# EAGLE design sib_schem (EAGLE 5.11)
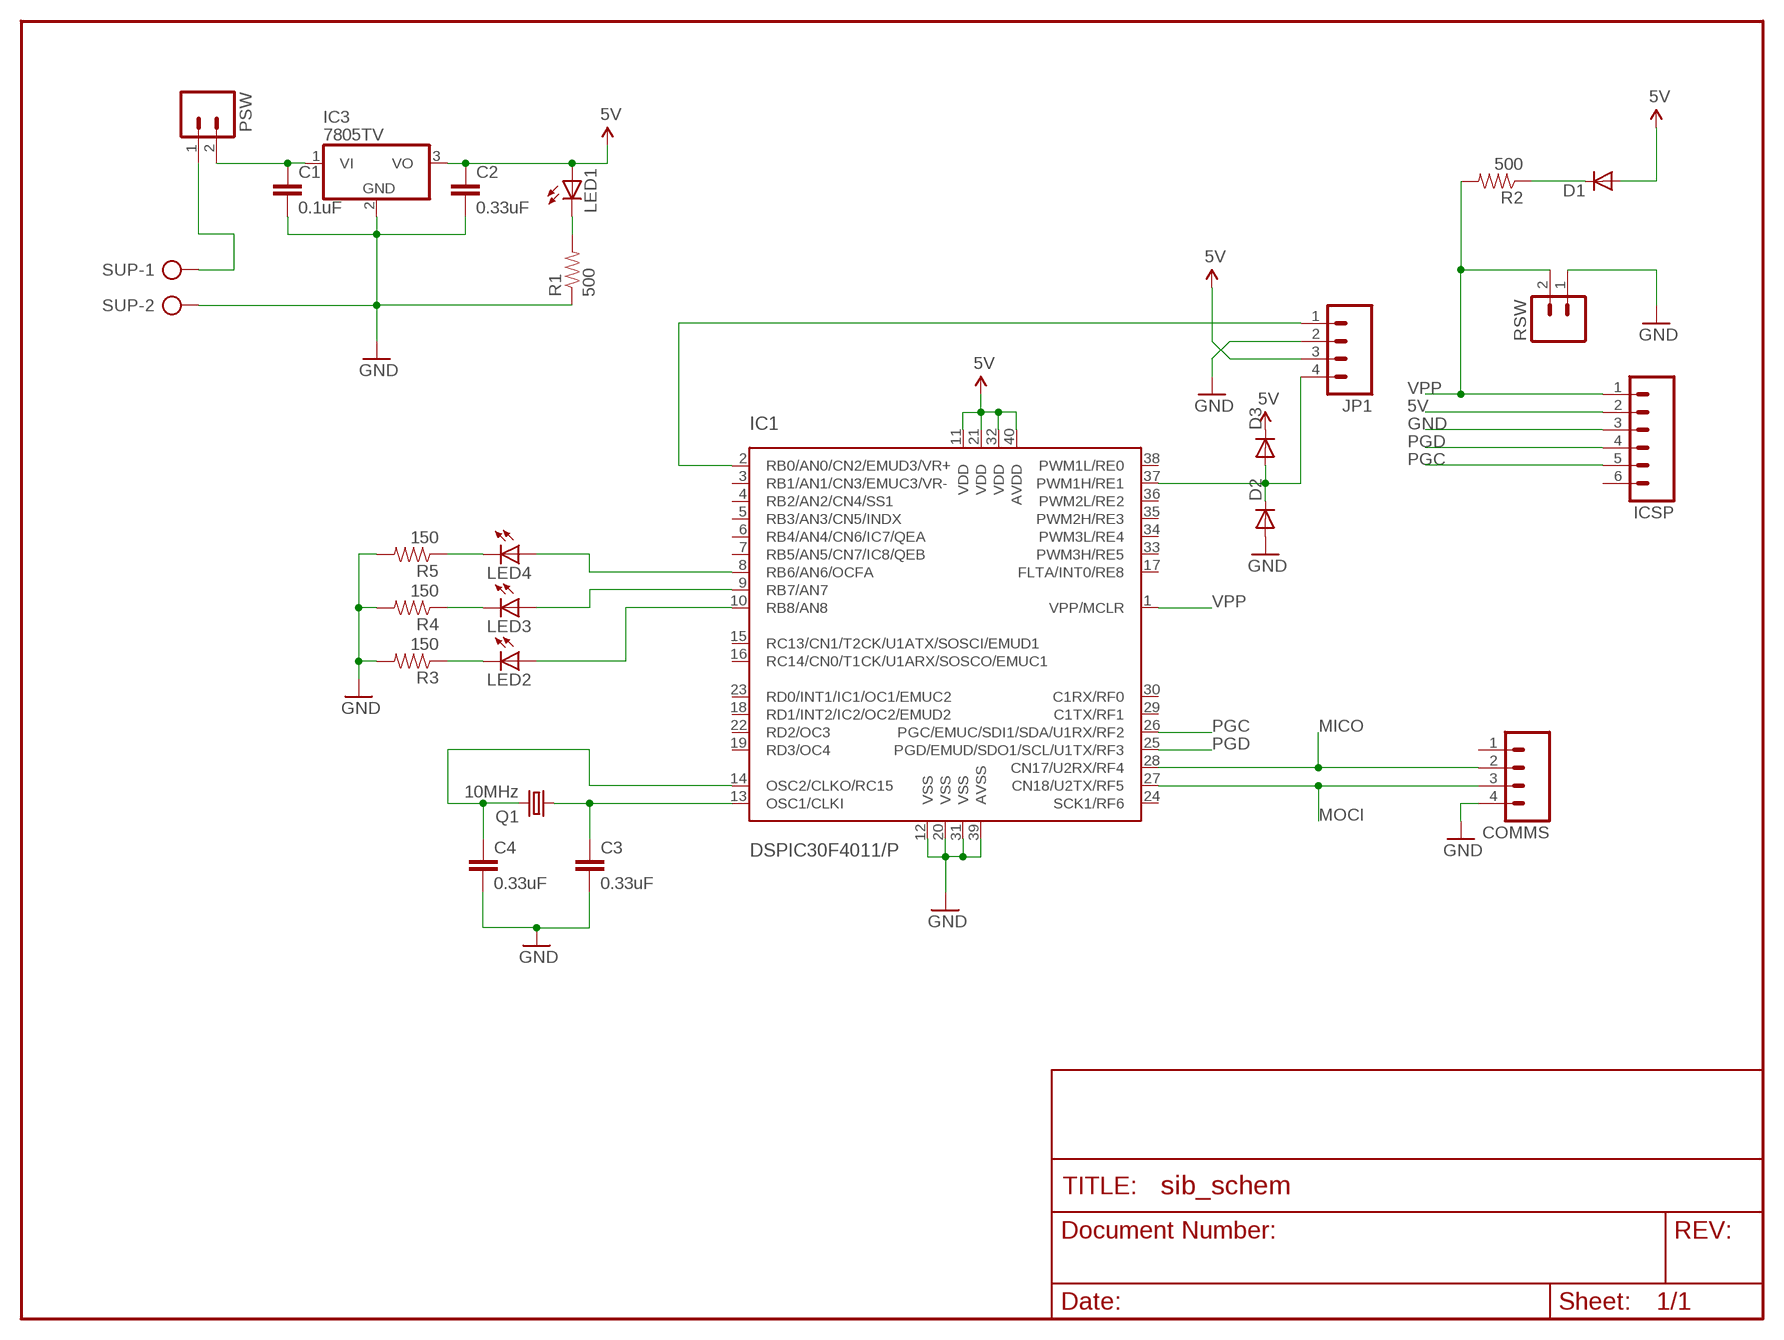
[diagram p0: schematic, sheet 1]

## Parts
C1  0.1uF  CAPPTH  [CAP-PTH-SMALL]
C2  0.33uF  CAPPTH  [CAP-PTH-SMALL]
C3  0.33uF  CAPPTH  [CAP-PTH-SMALL]
C4  0.33uF  CAPPTH  [CAP-PTH-SMALL]
COMMS  M04LONGPADS  [1X04_LONGPADS]
D1  DIODE1N4148  [DIODE-1N4148]
D2  DIODE1N4148  [DIODE-1N4148]
D3  DIODE1N4148  [DIODE-1N4148]
IC1  DSPIC30F4011/P  [DIL40]
IC3  7805TV  [TO220V]
ICSP  M06LONGPADS  [1X06_LONGPADS]
JP1  M04LONGPADS  [1X04_LONGPADS]
LED1  LED3MM  [LED3MM]
LED2  LED3MM  [LED3MM]
LED3  LED3MM  [LED3MM]
LED4  LED3MM  [LED3MM]
PSW  M02LOCK_LONGPADS  [1X02_LOCK_LONGPADS]
Q1  10MHz  CRYSTALHC49US  [HC49US]
R1  500  RESISTORPTH1  [AXIAL-0.3]
R2  500  RESISTORPTH1  [AXIAL-0.3]
R3  150  RESISTORPTH1  [AXIAL-0.3]
R4  150  RESISTORPTH1  [AXIAL-0.3]
R5  150  RESISTORPTH1  [AXIAL-0.3]
RSW  M02LOCK_LONGPADS  [1X02_LOCK_LONGPADS]
SUP  AK500/2-H  [AK500/2-H]

## Nets
5V: C2.1 D1.A D3.C IC1.11(VDD) IC1.21(VDD) IC1.32(VDD) IC1.40(AVDD) IC3.3(VO) ICSP.2 JP1.3 LED1.A
GND: C1.2 C2.2 C3.2 C4.2 COMMS.4 D2.A IC1.12(VSS) IC1.20(VSS) IC1.31(VSS) IC1.39(AVSS) IC3.2(GND) ICSP.3 JP1.2 R1.P$1 R3.P$2 R4.P$2 R5.P$2 RSW.1 SUP.2
MICO: COMMS.2 IC1.28(CN17/U2RX/RF4)
MOCI: COMMS.3 IC1.27(CN18/U2TX/RF5)
N$1: C1.1 IC3.1(VI) PSW.2
N$2: PSW.1 SUP.1
N$3: LED1.K(C) R1.P$2
N$4: D1.C R2.P$1
N$5: C3.1 IC1.13(OSC1/CLKI) Q1.1
N$6: C4.1 IC1.14(OSC2/CLKO/RC15) Q1.2
N$7: IC1.10(RB8/AN8) LED2.A
N$8: LED2.K(C) R3.P$1
N$9: IC1.2(RB0/AN0/CN2/EMUD3/VR+) JP1.1
N$10: LED3.K(C) R4.P$1
N$11: LED4.K(C) R5.P$1
N$12: IC1.9(RB7/AN7) LED3.A
N$13: IC1.8(RB6/AN6/OCFA) LED4.A
N$14: D2.C D3.A IC1.37(PWM1H/RE1) JP1.4
PGC: IC1.26(PGC/EMUC/SDI1/SDA/U1RX/RF2) ICSP.5
PGD: IC1.25(PGD/EMUD/SDO1/SCL/U1TX/RF3) ICSP.4
VPP: IC1.1(VPP/MCLR) ICSP.1 R2.P$2 RSW.2
Unconnected: COMMS.1 IC1.3(RB1/AN1/CN3/EMUC3/VR-) IC1.4(RB2/AN2/CN4/SS1) IC1.5(RB3/AN3/CN5/INDX) IC1.6(RB4/AN4/CN6/IC7/QEA) IC1.7(RB5/AN5/CN7/IC8/QEB) IC1.15(RC13/CN1/T2CK/U1ATX/SOSCI/EMUD1) IC1.16(RC14/CN0/T1CK/U1ARX/SOSCO/EMUC1) IC1.17(FLTA/INT0/RE8) IC1.18(RD1/INT2/IC2/OC2/EMUD2) IC1.19(RD3/OC4) IC1.22(RD2/OC3) IC1.23(RD0/INT1/IC1/OC1/EMUC2) IC1.24(SCK1/RF6) IC1.29(C1TX/RF1) IC1.30(C1RX/RF0) IC1.33(PWM3H/RE5) IC1.34(PWM3L/RE4) IC1.35(PWM2H/RE3) IC1.36(PWM2L/RE2) IC1.38(PWM1L/RE0) ICSP.6

## Library data of the parts
C1-C4 = SparkFun:CAP: Capacitor Standard 0603 ceramic capacitor, and 0.1" leaded capacitor.
COMMS JP1 = SparkFun:M04: Header 4 Standard 4-pin 0.1" header. Use with straight break away headers (SKU : PRT-00116), right angle break away headers (PRT-00553), swiss pins (PRT-00743), machine pins (PRT-00117), and female headers (PRT-00115). Molex polarized connector foot print use with SKU : PRT-08231 with associated crimp pins and housings. 1MM SMD Version SKU: PRT-10208
D1-D3 = SparkFun:DIODE: Diode These are standard reverse protection diodes and small signal diodes. SMA package can handle up to about 1A. SOD-323 can handle about 200mA. What the SOD-323 package when ordering, there are some mfgs out there that are 5-pin packages.
IC1 = microchip-dspic:DSPIC30F4011: dsPIC Motion Controller DSC
IC3 = linear:78*: Positive VOLTAGE REGULATOR Source: http://cache.national.com/ds/LM/LM78L05.pdf http://www.fairchildsemi.com/ds/LM/LM7805.pdf
ICSP = SparkFun:M06: Header 6 Standard 6-pin 0.1" header. Use with straight break away headers (SKU : PRT-00116), right angle break away headers (PRT-00553), swiss pins (PRT-00743), machine pins (PRT-00117), and female headers (PRT-00115). Molex polarized connector foot print use with SKU : PRT-08094 with associated crimp pins and housings. NOTES ON THE VARIANTS LOCK and LOCK_LONGPADS... This footprint was designed to help hold the alignment of a through-hole component (i.e. 6-pin header) while soldering it into place. You may notice that each hole has been shifted either up or down by 0.005 of an inch from it's more standard position (which is a perfectly straight line). This slight alteration caused the pins (the squares in the middle) to touch the edges of the holes. Because they are alternating, it causes a "brace" to hold the component in place. 0.005 has proven to be the perfect amount of "off-center" position when using our standard breakaway headers. Although looks a little odd when you look at the bare footprint, once you have a header in there, the alteration is very hard to notice. Also, if you push a header all the way into place, it is covered up entirely on the bottom side. This idea of altering the position of holes to aid alignment will be further integrated into the Sparkfun Library for other footprints. It can help hold any component with 3 or more connection pins.
LED1-LED4 = SparkFun:LED: LEDs Standard schematic elements and footprints for 5mm, 3mm, 1206, and 0603 sized LEDs. 5mm - Spark Fun Electronics SKU : COM-00529 (and others)
PSW RSW = SparkFun:M02: Header 2 Standard 2-pin 0.1" header. Use with straight break away headers (SKU : PRT-00116), right angle break away headers (PRT-00553), swiss pins (PRT-00743), machine pins (PRT-00117), and female headers (PRT-00115). Molex polarized connector foot print use with SKU : PRT-08233 with associated crimp pins and housings.
Q1 = SparkFun:CRYSTAL: Crystals Various standard crystals. Proven footprints. Spark Fun Electronics SKU : COM-00534
R1-R5 = SparkFun:RESISTOR: Resistor Basic schematic elements and footprints for 0603, 1206, and PTH 1/10th watt (small) resistors.
SUP = con-ptr500:AK500/2-H: CONNECTOR Aug. 2004 / PTR Meßtechnik: Die Bezeichnung der Serie AK505 wurde geändert. Es handelt sich hierbei um AK500 in horizontaler Ausführung.

## Net classes
1 supply: width 0.508 mm

## Board
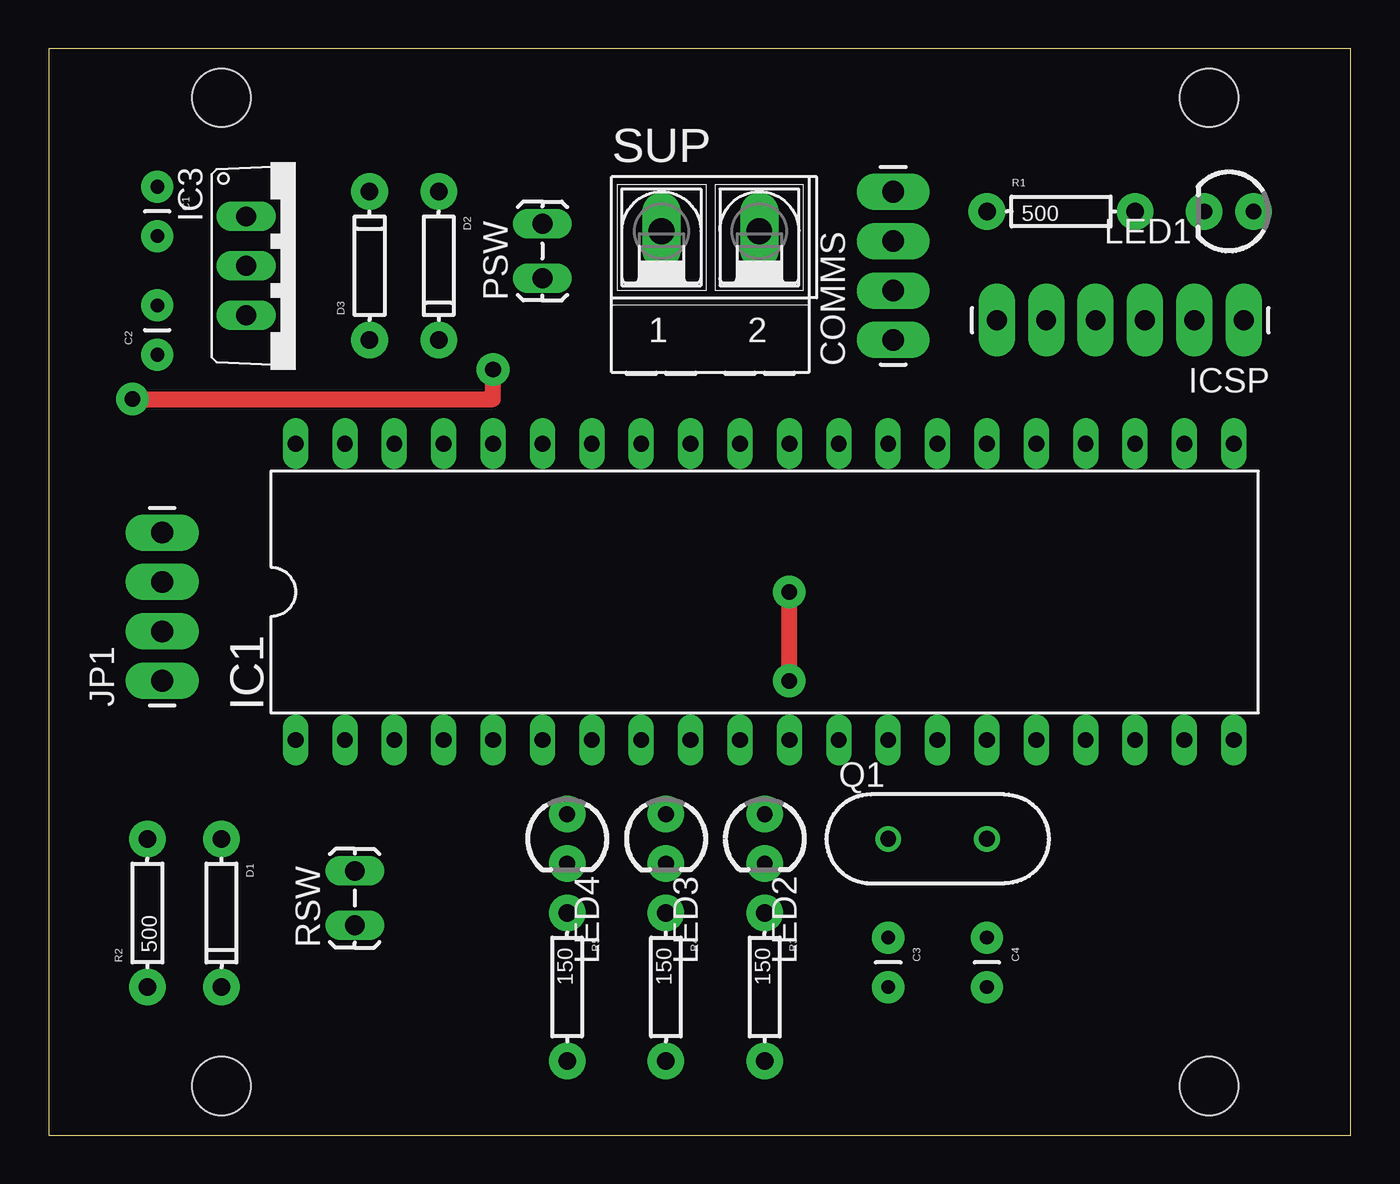
[diagram p1: board, top side]
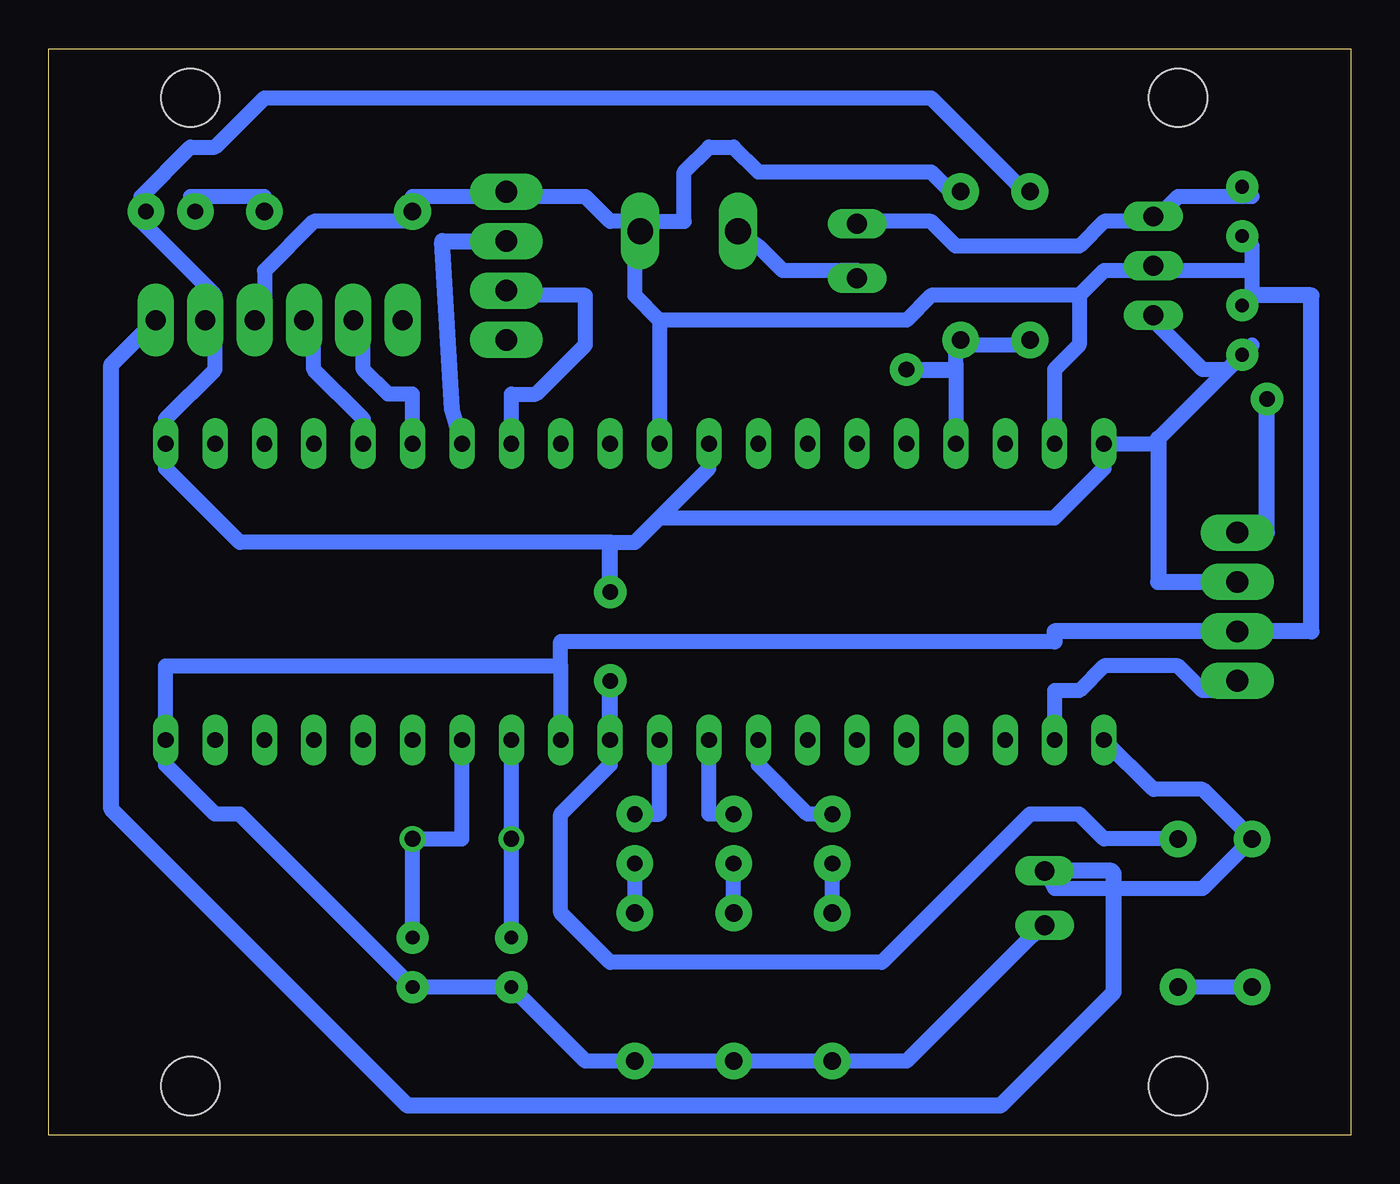
[diagram p2: board, bottom side, seen from below]

Size 66.98 x 55.87 mm. Coordinates in mm from the lower left corner, seen from the top.
Outline: 0,0 66.98,0 66.98,55.87 0,55.87 0,0
Copper layers (1*16): Top 0.035mm / dielectric 1.5mm / Bottom 0.035mm
Design rules "default *": minimum track width 30mil, minimum drill 24mil, track to track 30mil, track to pad 20mil, pad to pad 20mil, via to via 20mil, smd to smd 8mil, copper to edge 20mil, drill to drill 8mil, minimum pad ring 10mil, minimum via ring 8mil, stop-mask expansion 4mil, vias tented up to drill 0mil, thermal gap 10mil
Holes 3 mm at 8.89,2.54 59.69,2.54 59.69,53.34 8.89,53.34

### Footprints (pad centres in the part's own frame; a part is rotated, then mirrored left to right if it is on the bottom)
CAP-PTH-SMALL = drill 0.7 pad 1.651 round: 1 0,0; 2 2.54,0
1X04_LONGPADS = drill 1.118 pad 1.88 long: 1 0,0; 2 2.54,0; 3 5.08,0; 4 7.62,0
DIODE-1N4148 = drill 0.9 pad 1.88 round: A -3.81,0; C 3.81,0
DIL40 = drill 0.813 long: 1 -24.13,-7.62; 2 -21.59,-7.62; 3 -19.05,-7.62; 4 -16.51,-7.62; 5 -13.97,-7.62; 6 -11.43,-7.62; 7 -8.89,-7.62; 8 -6.35,-7.62; 9 -3.81,-7.62; 10 -1.27,-7.62; 11 1.27,-7.62; 12 3.81,-7.62; 13 6.35,-7.62; 14 8.89,-7.62; 15 11.43,-7.62; 16 13.97,-7.62; 17 16.51,-7.62; 18 19.05,-7.62; 19 21.59,-7.62; 20 24.13,-7.62; 21 24.13,7.62; 22 21.59,7.62; 23 19.05,7.62; 24 16.51,7.62; 25 13.97,7.62; 26 11.43,7.62; 27 8.89,7.62; 28 6.35,7.62; 29 3.81,7.62; 30 1.27,7.62; 31 -1.27,7.62; 32 -3.81,7.62; 33 -6.35,7.62; 34 -8.89,7.62; 35 -11.43,7.62; 36 -13.97,7.62; 37 -16.51,7.62; 38 -19.05,7.62; 39 -21.59,7.62; 40 -24.13,7.62
TO220V = drill 1.016 long: 1 -2.54,-2.54; 2 0,-2.54; 3 2.54,-2.54
1X06_LONGPADS = drill 1.016 pad 1.88 long: 1 0,0; 2 2.54,0; 3 5.08,0; 4 7.62,0; 5 10.16,0; 6 12.7,0
LED3MM = drill 0.813 pad 1.88 round: A -1.27,0; K 1.27,0
1X02_LOCK_LONGPADS = drill 1.016 long: 1 -0.127,0; 2 2.667,0
HC49US = drill 0.813 round: 1 -2.54,0; 2 2.54,0
AXIAL-0.3 = drill 0.9 pad 1.88 round: P$1 -3.81,0; P$2 3.81,0
AK500/2-H = drill 1.321 long: 1 -2.515,0; 2 2.515,0

### Placement (x,y rotation side)
C1  5.59,48.77 270 top
C2  5.59,40.13 90 top
C3  43.18,10.16 270 top
C4  48.26,10.16 270 top
COMMS  43.43,40.89 90 top
D1  8.89,11.43 270 top
D2  20.07,44.7 270 top
D3  16.51,44.7 90 top
DRILEGEND  [DRILEGEND]  0,-3.81 0 top  (outside the outline)
IC1  36.83,27.94 0 top
IC3  12.7,44.7 270 top
ICSP  61.47,41.91 180 top
JP1  5.84,23.37 90 top
LED1  60.71,47.5 180 top
LED2  36.83,15.24 270 top
LED3  31.75,15.24 270 top
LED4  26.67,15.24 270 top
PSW  25.4,44.2 90 top
Q1  45.72,15.24 0 top
R1  52.07,47.5 0 top
R2  5.08,11.43 90 top
R3  36.83,7.62 270 top
R4  31.75,7.62 270 top
R5  26.67,7.62 270 top
RSW  15.75,10.92 90 top
SUP  34.04,46.48 0 top

### Tracks (layer width: path | path; a pad name or v marks a point on that pad's centre or on a via)
5V  (via drill 0.8 pad 1.68)
  Top 0.813: v38.1,23.37 v38.1,27.94
  Bottom 0.762: 58.42,41.91 58.42,43.18 62.23,46.99 LED1.A 62.23,48.26 59.69,50.8 58.42,50.8 55.88,53.34 21.59,53.34 16.51,48.26 D3.C | IC1.32 33.02,34.29 35.56,31.75 | 35.56,31.75 36.83,30.48 38.1,30.48 57.15,30.48 60.96,34.29 IC1.21 60.96,36.83 58.42,39.37 58.42,41.91 | 58.42,41.91 ICSP.2 | IC1.11 38.1,19.05 40.64,16.51 40.64,11.43 38.1,8.89 24.13,8.89 16.51,16.51 13.97,16.51 12.7,15.24 D1.A | 6.35,39.37 9.91,35.81 10.16,35.56 IC1.40 12.7,34.29 15.24,31.75 35.56,31.75 | 6.35,39.37 C2.1 5.08,40.64 | 6.35,39.37 7.62,39.37 10.16,41.91 IC3.3
  Bottom 0.813: JP1.3 9.91,28.45 9.91,35.81 | IC1.11 v38.1,23.37 | v38.1,27.94 38.1,30.48
GND
  Bottom 0.762: ICSP.3 55.88,41.91 55.88,44.45 53.34,46.99 48.26,46.99 R1.P$1 48.26,48.26 44.45,48.26 COMMS.4 43.18,48.26 39.37,48.26 38.1,46.99 36.83,46.99 SUP.2 | RSW.1 16.51,10.16 22.86,3.81 R5.P$2 R4.P$2 R3.P$2 39.37,3.81 C3.2 C4.2 57.15,16.51 58.42,16.51 60.96,19.05 IC1.20 60.96,24.13 40.64,24.13 | 40.64,24.13 40.64,25.4 15.24,25.4 | 40.64,24.13 IC1.12 | 5.08,44.45 5.08,45.72 C1.2 | 5.08,44.45 5.08,43.18 C2.2 | IC1.39 15.24,39.37 13.97,40.64 13.97,43.18 | 13.97,43.18 12.7,44.45 10.16,44.45 | 5.08,44.45 10.16,44.45 | 10.16,44.45 IC3.2 | 35.56,41.91 IC1.31 | 35.56,41.91 36.83,43.18 36.83,45.72 SUP.2 | D2.A 20.32,48.26 21.59,49.53 30.48,49.53 31.75,50.8 33.02,50.8 34.29,49.53 34.29,46.99 35.56,46.99 SUP.2 | 13.97,43.18 21.59,43.18 22.86,41.91 35.56,41.91
  Bottom 0.813: 5.08,43.18 2.03,43.18 2.03,25.91 JP1.2 15.24,25.91 15.24,25.4
MICO
  Bottom 0.762: IC1.28 43.18,38.1 41.91,38.1 39.37,40.64 39.37,43.18 43.18,43.18 COMMS.2
MOCI
  Bottom 0.813: COMMS.3 46.74,45.97 46.23,37.34 IC1.27
N$1
  Bottom 0.762: 10.16,46.99 8.89,48.26 5.08,48.26 C1.1 | 10.16,46.99 12.7,46.99 13.97,45.72 20.32,45.72 21.59,46.99 25.4,46.99 PSW.2 | 10.16,46.99 IC3.1
N$2
  Bottom 0.762: PSW.1 25.4,44.45 29.21,44.45 30.48,45.72 SUP.1
N$3
  Bottom 0.762: R1.P$2 55.88,48.26 59.69,48.26 LED1.K
N$4
  Bottom 0.762: R2.P$1 D1.C
N$5
  Bottom 0.762: C3.1 Q1.1 IC1.13
N$6
  Bottom 0.762: C4.1 Q1.2 45.72,15.24 IC1.14
N$7
  Bottom 0.762: IC1.10 35.56,16.51 LED2.A
N$8
  Bottom 0.762: R3.P$1 LED2.K
N$9
  Bottom 0.762: IC1.2 15.24,22.86 13.97,22.86 12.7,24.13 8.89,24.13 7.62,22.86 6.35,22.86 JP1.1
N$10
  Bottom 0.762: R4.P$1 LED3.K
N$11
  Bottom 0.762: R5.P$1 LED4.K
N$12
  Bottom 0.762: IC1.9 33.02,16.51 LED3.A
N$13
  Bottom 0.762: IC1.8 30.48,19.05 27.94,16.51 LED4.A
N$14  (via drill 0.8 pad 1.68)
  Top 0.813: v4.32,37.85 22.86,37.85 v22.86,39.37
  Bottom 0.762: 20.32,40.64 20.32,39.62 IC1.37 | 20.32,40.64 16.51,40.64 D3.A | 20.32,40.64 D2.C
  Bottom 0.813: JP1.4 4.32,30.99 v4.32,37.85 | v22.86,39.37 20.32,39.37 20.32,39.62
PGC
  Bottom 0.762: IC1.26 48.26,38.1 49.53,38.1 50.8,39.37 50.8,41.91 ICSP.5
PGD
  Bottom 0.762: IC1.25 50.8,36.83 53.34,39.37 53.34,41.91 ICSP.4
VPP
  Bottom 0.762: IC1.1 10.16,17.78 7.62,17.78 R2.P$2 7.62,12.7 15.24,12.7 RSW.2
  Bottom 0.813: ICSP.1 63.75,39.62 63.75,16.76 48.51,1.52 18.03,1.52 12.19,7.37 12.19,13.46 12.32,13.59 RSW.2